# Altium schematic sheet PCB_esp32_pico d4 video_2022-03-13.schdoc
size 377 x 209 mm
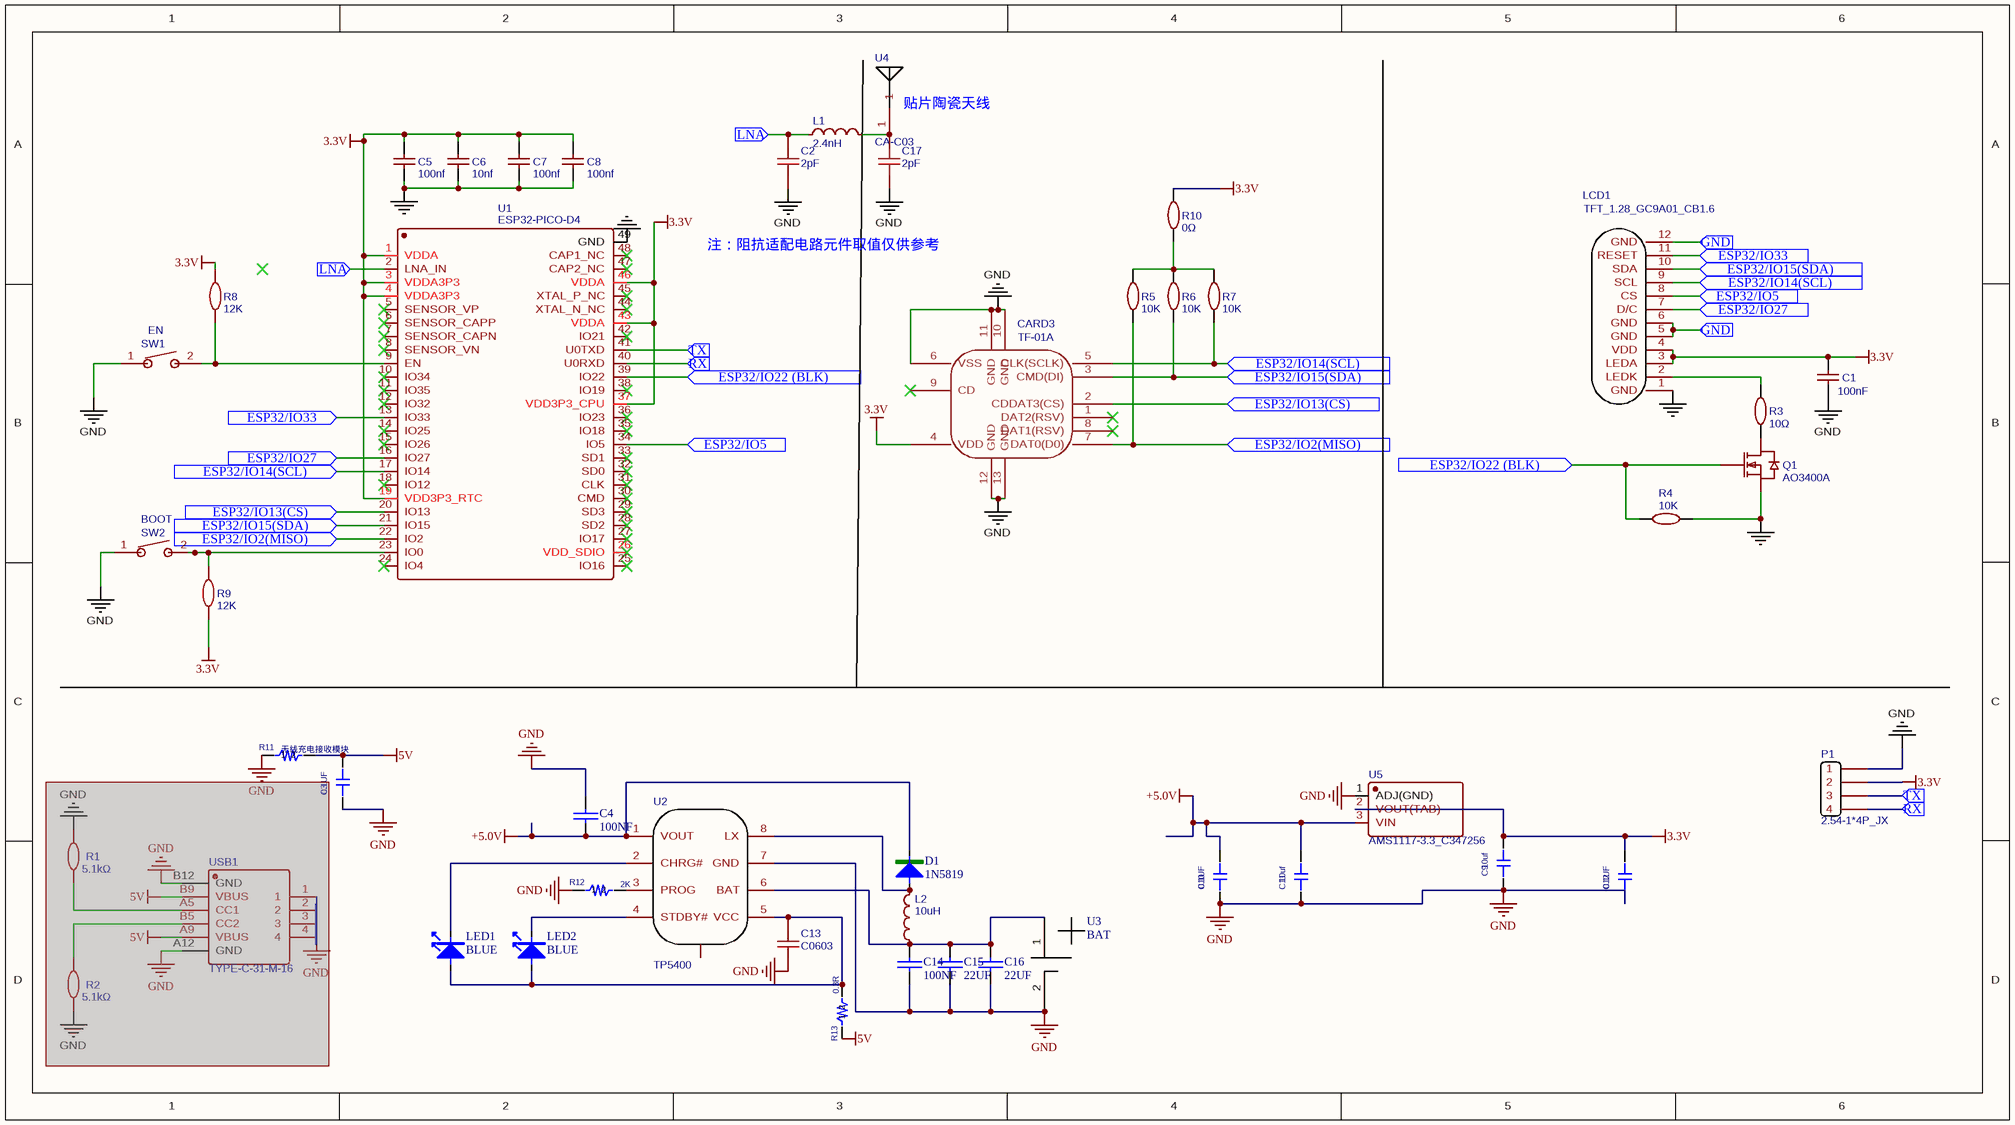
[diagram p0: PCB_esp32_pico d4 video_2022-03-13.schdoc]

## Parts
BOOT  SW2  [SW-SMD_L4.0-W2.9-P4.15-EH]
C1  100nF  [C0402]
C2  2pF  [C0402]
C3  value 0.1UF  [C0402]  (hidden comment: C0402)
C4  100NF  [C0402]
C5  100nf  [C0402]
C6  10nf  [C0402]
C7  100nf  [C0402]
C8  100nf  [C0402]
C9  value 10uf  [C0402]  (hidden comment: C0402)
C10  value 0.1UF  [C0402]  (hidden comment: C0402)
C11  value 10uf  [C0402]  (hidden comment: C0402)
C12  value 0.1UF  [C0402]  (hidden comment: C0402)
C13  C0603  [C0402]
C14  100NF  [C0402]
C15  22UF  [C0402]
C16  22UF  [C0402]
C17  2pF  [C0402]
CARD3  TF-01A  [TF-SMD_TF-01A]
D1  1N5819  [SOT-89_L4.5-W2.5-P1.50-LS4.2-BR - duplicate]
EN  SW1  [SW-SMD_L4.0-W2.9-P4.15-EH]
L1  2.4nH  [C0402]
L2  10uH  [IND-SMD_L4.0-W4.0]
LCD1  TFT_1.28_GC9A01_CB1.6  [TFT_1.28_GC9A01_CB0.8]
LED1  BLUE  [LED0603-R-RD]
LED2  BLUE  [LED0603-R-RD]
P1  2.54-1*4P_JX  [2.54-1*4P_TIGHT_JX]
Q1  AO3400A  [SOT-23-3_L2.9-W1.6-P1.90-LS2.8-BR]
R1  5.1kΩ  [R0402]  (masked out: inside a compile mask, not in the netlist)
R2  5.1kΩ  [R0402]  (masked out: inside a compile mask, not in the netlist)
R3  10Ω  [R0402]
R4  10K  [R0402]
R5  10K  [R0402]
R6  10K  [R0402]
R7  10K  [R0402]
R8  12K  [R0402]
R9  12K  [R0402]
R10  0Ω  [R0603]
R11  value 无线充电接收模块  [R_0603]  (hidden comment: R0603)
R12  value 2K  [R_0603]  (hidden comment: R0603)
R13  value 0.3R  [R_0603]  (hidden comment: R0603)
U1  ESP32-PICO-D4  [QFN-48_L7.0-W7.0-P0.50-BL-EP5.4]
U2  TP5400  [SOIC-8_L5.0-W4.0-P1.27-LS6.0-BL-EP2.0]
U3  BAT  [C0402]
U4  CA-C03  [ANT2051]
U5  AMS1117-3.3_C347256  [SOT-89_L4.5-W2.5-P1.50-LS4.2-BR]
USB1  TYPE-C-31-M-16  [TYPE-C-SMD_TYPE-C-31-M-16]  (masked out: inside a compile mask, not in the netlist)

## Ports
ESP32/IO2(MISO) (in), ESP32/IO5 (in), ESP32/IO13(CS) (in), ESP32/IO14(SCL) (in), ESP32/IO15(SDA) (in), ESP32/IO22 (BLK) (in), ESP32/IO27 (in), ESP32/IO33 (in), GND (in), LNA (in), RX (in), TX (in)

## Nets
3.3V: C1.1 C5.2 C6.2 C7.2 C8.2 C9.2 C12.2 CARD3.4(VDD) LCD1.3(LEDA) LCD1.4(VDD) P1.2 R8.2 R9.1 R10.1 U1.1(VDDA) U1.3(VDDA3P3) U1.4(VDDA3P3) U1.19(VDD3P3_RTC) U1.37(VDD3P3_CPU) U1.43(VDDA) U1.46(VDDA) U5.2(VOUT(TAB))
5V: C3.2 R11.2 R13.1
+5.0V: C4.2 C10.2 C11.2 D1.2 U2.1(VOUT) U5.3(VIN)
GND: BOOT.1 C1.2 C2.1 C3.1 C4.1 C5.1 C6.1 C7.1 C8.1 C9.1 C10.1 C11.1 C12.1 C13.1 C14.2 C15.2 C16.2 C17.1 CARD3.6(VSS) CARD3.10(GND) CARD3.11(GND) CARD3.12(GND) CARD3.13(GND) EN.1 LCD1.1(GND) P1.1 Q1.2(S) R4.2 R11.1 R12.1 U1.49(GND) U2.7(GND) U3.2(-) U5.1(ADJ(GND))
ESP32/IO2(MISO): CARD3.7(DAT0(D0)) R5.2 U1.22(IO2) ; port ESP32/IO2(MISO)
ESP32/IO5: LCD1.8(CS) U1.34(IO5) ; port ESP32/IO5
ESP32/IO13(CS): CARD3.2(CDDAT3(CS)) U1.20(IO13) ; port ESP32/IO13(CS)
ESP32/IO14(SCL): CARD3.5(CLK(SCLK)) LCD1.9(SCL) R7.2 U1.17(IO14) ; port ESP32/IO14(SCL)
ESP32/IO15(SDA): CARD3.3(CMD(DI)) LCD1.10(SDA) R6.2 U1.21(IO15) ; port ESP32/IO15(SDA)
ESP32/IO22 (BLK): Q1.1(G) R4.1 U1.39(IO22) ; port ESP32/IO22 (BLK)
ESP32/IO27: LCD1.7(D/C) U1.16(IO27) ; port ESP32/IO27
ESP32/IO33: LCD1.11(RESET) U1.13(IO33) ; port ESP32/IO33
GND: LCD1.5(GND) LCD1.6(GND) LCD1.12(GND) ; port GND  [a separate net that carries the same name]
LNA: C2.2 L1.1 U1.2(LNA_IN) ; port LNA
RX: P1.4 U1.40(U0RXD) ; port RX
TX: P1.3 U1.41(U0TXD) ; port TX
NetBOOT_2: BOOT.2 R9.2 U1.23(IO0)
NetC13_2: C13.2 LED1.1 LED2.1 R13.2 U2.5(VCC)
NetC14_1: C14.1 C15.1 C16.1 L2.1 U2.6(BAT) U3.1(+)
NetC17_2: C17.2 L1.2 U4.1
NetD1_1: D1.1 L2.2 U2.8(LX)
NetEN_2: EN.2 R8.1 U1.9(EN)
NetLCD1_2: LCD1.2(LEDK) R3.1
NetLED1_2: LED1.2 U2.2(CHRG#)
NetLED2_2: LED2.2 U2.4(STDBY#)
NetQ1_3: Q1.3(D) R3.2
NetR5_1: R5.1 R6.1 R7.1 R10.2
NetR12_2: R12.2 U2.3(PROG)

Not connected (* = marked no-connect by the designer): CARD3 1(DAT2(RSV))* 8(DAT1(RSV))* 9(CD)*; U1 5(SENSOR_VP)* 6(SENSOR_CAPP)* 7(SENSOR_CAPN)* 8(SENSOR_VN)* 10(IO34)* 11(IO35)* 12(IO32)* 14(IO25)* 15(IO26)* 18(IO12)* 24(IO4)* 25(IO16)* 26(VDD_SDIO)* 27(IO17)* 28(SD2)* 29(SD3)* 30(CMD)* 31(CLK)* 32(SD0)* 33(SD1)* 35(IO18)* 36(IO23)* 38(IO19)* 42(IO21)* 44(XTAL_N_NC)* 45(XTAL_P_NC)* 47(CAP2_NC)* 48(CAP1_NC)*; U2 9

## Notes on the sheet
- 注：阻抗适配电路元件取值仅供参考
- (in symbol CA-C03) 贴片陶瓷天线

## Library data of the parts
BOOT = SW2: BOM_Manufacturer: BRIGHT; BOM_Manufacturer Part: TSA343G00D-250J2; Contributor: LCSC; BOM_Supplier: LCSC; BOM_Supplier Part: C354947; BOM_JLCPCB Part Class: Extended Part; spicePre: S; spiceSymbolName: TSA343G00D-250J2
C1 = 100nF: BOM_Manufacturer: YAGEO; BOM_Manufacturer Part: CC0402KRX5R9BB104; nameAlias: Capacitance; BOM_Supplier: LCSC; BOM_Supplier Part: C105882; BOM_JLCPCB Part Class: Extended Part; spicePre: C; spiceSymbolName: CC0402KRX5R9BB104
C2 C17 = 2pF: nameAlias: Value(F); Contributor: LCEDA_Lib; spicePre: C; spiceSymbolName: C_0402_US
C3 C9-C12 = C0402: PCB DECAL: CAP_0603_FIRE
C4 C14-C16 = C0805: Capacitor
C5 C7 C8 = 10uF: BOM_Manufacturer Part: CL05A106MQ5NUNC; BOM_Manufacturer: SAMSUNG; nameAlias: Capacitance; BOM_Supplier: LCSC; BOM_Supplier Part: C15525; BOM_JLCPCB Part Class: Basic Part; spicePre: C; spiceSymbolName: CL05A106MQ5NUNC
C6 = 10uF: BOM_Manufacturer Part: CL05A106MQ5NUNC; BOM_Manufacturer: SAMSUNG; nameAlias: Capacitance; Package Display: No; BOM_Supplier: LCSC; BOM_Supplier Part: C15525; BOM_JLCPCB Part Class: Basic Part; spicePre: C; spiceSymbolName: CL05A106MQ5NUNC
C13 = C0603: BOM_Manufacturer: Samsung Electro-Mechanics; BOM_Manufacturer Part: 10uF; nameAlias: Value; Contributor: LCSC; BOM_Supplier: LCSC; BOM_Supplier Part: C15415; spicePre: C; spiceSymbolName: 10UF
CARD3 = TF-01A: BOM_Manufacturer: HRO; BOM_Supplier: LCSC; BOM_Manufacturer Part: TF-01A; BOM_Supplier Part: C91145; BOM_JLCPCB Part Class: Extended Part; spicePre: C; spiceSymbolName: TF-01A
D1 = 1N5819: 肖特基二极管
EN = SW1: BOM_Manufacturer: BRIGHT; BOM_Manufacturer Part: TSA343G00D-250J2; Contributor: LCSC; BOM_Supplier: LCSC; BOM_Supplier Part: C354947; BOM_JLCPCB Part Class: Extended Part; spicePre: S; spiceSymbolName: TSA343G00D-250J2
L1 = 2.4nH: nameAlias: Value(H); Contributor: LCEDA_Lib; spicePre: L; spiceSymbolName: L0402_US
L2 = 10uH: BOM_Manufacturer: Sunlord; BOM_Manufacturer Part: SWPA4030S100MT; nameAlias: Inductance; BOM_Supplier: LCSC; BOM_Supplier Part: C38117; BOM_JLCPCB Part Class: Extended Part; spicePre: L; spiceSymbolName: SWPA4030S100MT
LCD1 = TFT_1.28_GC9A01_CB1.6: Contributor: 启凡科创; spicePre: L; spiceSymbolName: TFT_1.28_GC9A01_CB1.6
LED1 LED2 = LED_B
Q1 = AO3400A: BOM_Manufacturer: AOS; BOM_Supplier: LCSC; BOM_Manufacturer Part: AO3400A; BOM_Supplier Part: C20917; BOM_JLCPCB Part Class: Basic Part; spicePre: Q; spiceSymbolName: AO3400A
R1 R2 = 5.1kΩ: BOM_Manufacturer: Tyohm; BOM_Manufacturer Part: RMC04025.1K5%N; Resistance (Ohms): 5.1K; nameAlias: Resistance; Contributor: LCSC; BOM_Supplier: LCSC; BOM_Supplier Part: C325524; spicePre: R; spiceSymbolName: RMC04025.1K5%N
R3 = 10Ω: BOM_Manufacturer: UniOhm; BOM_Manufacturer Part: 0402WGF100JTCE; nameAlias: Resistance; Resistance (Ohms): 10; BOM_Supplier: LCSC; BOM_Supplier Part: C25077; BOM_JLCPCB Part Class: Basic Part; spicePre: R; spiceSymbolName: 0402WGF100JTCE
R4-R7 = 10K: BOM_Manufacturer: UniOhm; BOM_Manufacturer Part: 0402WGF1002TCE; nameAlias: Resistance (Ohms); BOM_Supplier: LCSC; BOM_Supplier Part: C25744; BOM_JLCPCB Part Class: Basic Part; spicePre: R; spiceSymbolName: 0402WGF1002TCE
R8 R9 = 12K: BOM_Manufacturer: YAGEO; BOM_Manufacturer Part: AC0402JR-0712KL; nameAlias: Resistance (Ohms); Contributor: LCSC; Resistance: 12kΩ; BOM_Supplier: LCSC; BOM_Supplier Part: C227297; BOM_JLCPCB Part Class: Extended Part; spicePre: R; spiceSymbolName: AC0402JR-0712KL
R10 = 0Ω: BOM_Manufacturer: UniOhm; BOM_Manufacturer Part: 0603WAJ0000T5E; nameAlias: Resistance; Resistance (Ohms): 0; BOM_Supplier: LCSC; BOM_Supplier Part: C15402; BOM_JLCPCB Part Class: Extended Part; spicePre: R; spiceSymbolName: 0603WAJ0000T5E
U1 = ESP32-PICO-D4: BOM_Manufacturer: Espressif Systems; Contributor: LCSC; Package Display: No; BOM_Supplier: LCSC; BOM_Supplier Part: C193707; BOM_Manufacturer Part: ESP32-PICO-D4; BOM_JLCPCB Part Class: Extended Part; spicePre: U; spiceSymbolName: ESP32-PICO-D4
U2 = TP5400: 锂电池充放电; BOM_Manufacturer: TOPPOWER; BOM_Supplier: LCSC; BOM_Manufacturer Part: TP5400; BOM_Supplier Part: C24154; BOM_JLCPCB Part Class: Extended Part; spicePre: U; spiceSymbolName: TP5400
U4 = CA-C03: Contributor: BVREAVE; link: https://item.taobao.com/item.htm?spm=a230r.1.14.4.81c453c0MSMjjx&id=627328734225&ns=1&abbucket=1#detail; spicePre: U; spiceSymbolName: ANT_CrossAir_CA-C03
U5 = AMS1117-3.3_C347256: BOM_Manufacturer: Youtai Semiconductor Co., Ltd.; Contributor: LCSC; BOM_Supplier: LCSC; BOM_Supplier Part: C347256; BOM_Manufacturer Part: AMS1117-3.3; BOM_JLCPCB Part Class: Extended Part; spicePre: U; spiceSymbolName: AMS1117-3.3_C347256
USB1 = TYPE-C-31-M-16: BOM_Manufacturer: Korean Hroparts Elec; Contributor: LCSC; BOM_Supplier: LCSC; BOM_Supplier Part: C283541; BOM_Manufacturer Part: TYPE-C-31-M-16; BOM_JLCPCB Part Class: Extended Part; spicePre: U; spiceSymbolName: TYPE-C-31-M-16
P1 = 2.54-1*4P_JX: BOM_Supplier Part: C115245; BOM_Supplier: LCSC; spicePre: P; spiceSymbolName: 2.54-1*4P_JX
R11-R13 = R0603: PCB DECAL: R_0603